# EAGLE design hackeeg-connector-8-vertical (EAGLE 9.5.2)
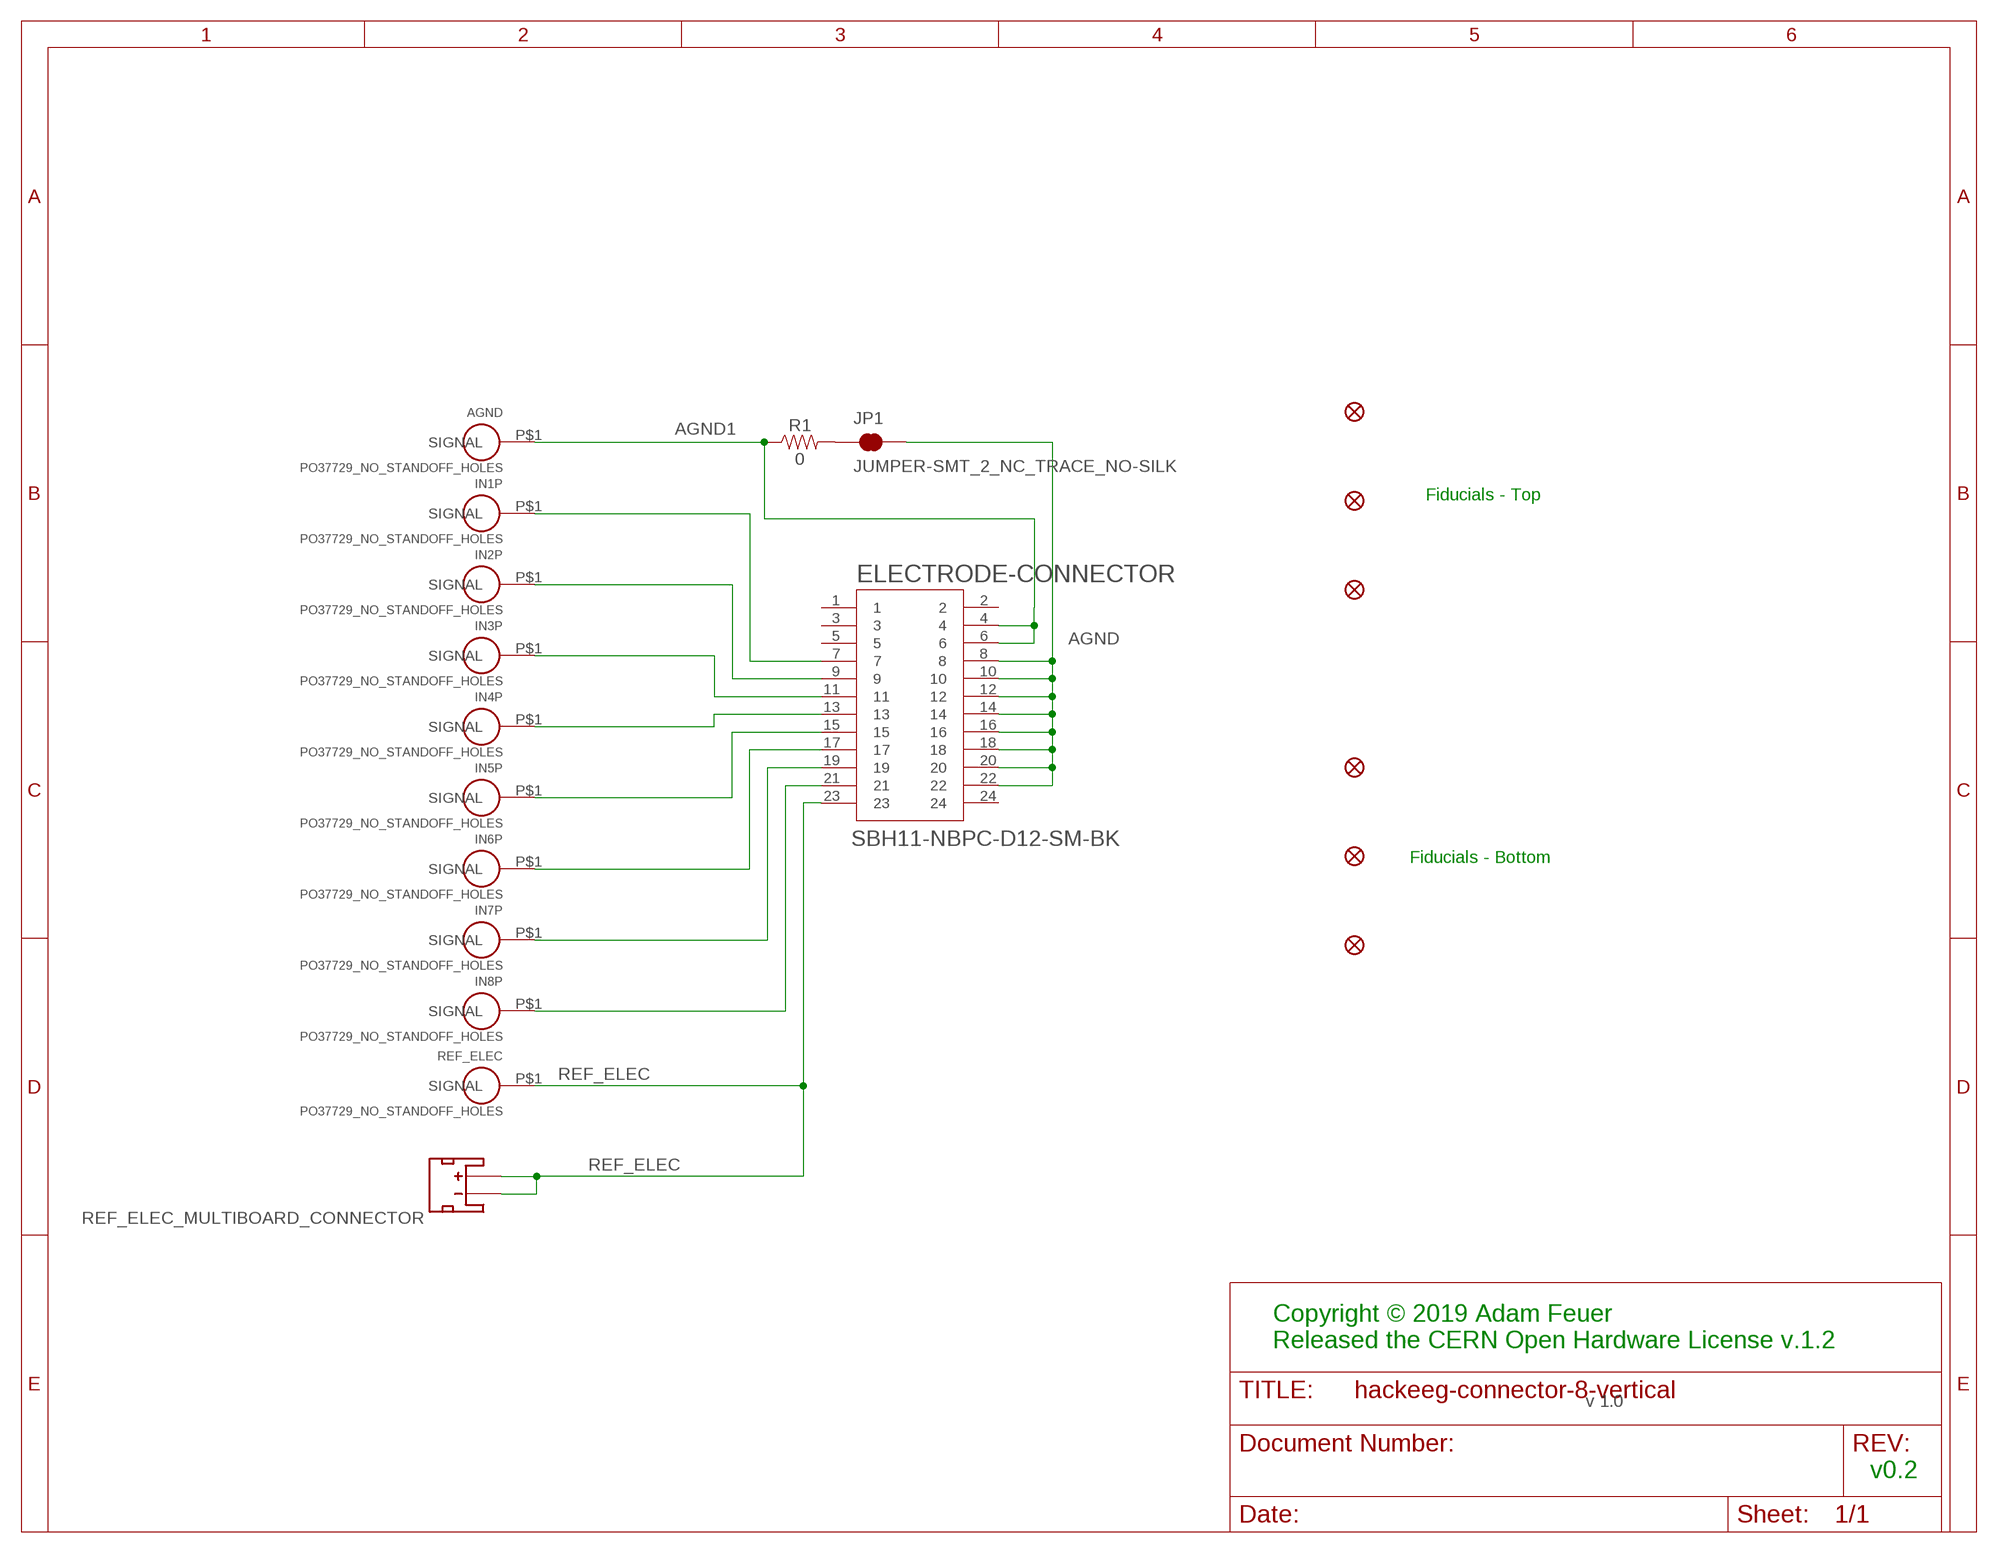
[diagram p0: schematic, sheet 1]

## Parts
AGND  PO37729_NO_STANDOFF_HOLES  [SIMPLE0]
ELECTRODE-CONNECTOR  SBH11-NBPC-D12-SM-BK  [SULLINS_SBH11-NBPC-D12-SM-BK]
FD1  FIDUCIAL1X2  [FIDUCIAL-1X2]
FD2  FIDUCIAL1X2  [FIDUCIAL-1X2]
FD3  FIDUCIAL1X2  [FIDUCIAL-1X2]
FD4  FIDUCIAL1X2  [FIDUCIAL-1X2]
FD5  FIDUCIAL1X2  [FIDUCIAL-1X2]
FD6  FIDUCIAL1X2  [FIDUCIAL-1X2]
IN1P  PO37729_NO_STANDOFF_HOLES  [SIMPLE0]
IN2P  PO37729_NO_STANDOFF_HOLES  [SIMPLE0]
IN3P  PO37729_NO_STANDOFF_HOLES  [SIMPLE0]
IN4P  PO37729_NO_STANDOFF_HOLES  [SIMPLE0]
IN5P  PO37729_NO_STANDOFF_HOLES  [SIMPLE0]
IN6P  PO37729_NO_STANDOFF_HOLES  [SIMPLE0]
IN7P  PO37729_NO_STANDOFF_HOLES  [SIMPLE0]
IN8P  PO37729_NO_STANDOFF_HOLES  [SIMPLE0]
JP1  JUMPER-SMT_2_NC_TRACE_NO-SILK  [SMT-JUMPER_2_NC_TRACE_NO-SILK]
R1  0  0OHM-0603-1/10W-5%  [0603]
REF_ELEC  PO37729_NO_STANDOFF_HOLES  [SIMPLE0]
REF_ELEC_MULTIBOARD_CONNECTOR  JST_2MM_MALE  [JST-2-SMD]

## Nets
AGND: ELECTRODE-CONNECTOR.8 ELECTRODE-CONNECTOR.10 ELECTRODE-CONNECTOR.12 ELECTRODE-CONNECTOR.14 ELECTRODE-CONNECTOR.16 ELECTRODE-CONNECTOR.18 ELECTRODE-CONNECTOR.20 ELECTRODE-CONNECTOR.22 JP1.2
AGND1: AGND.P$1(SIGNAL) ELECTRODE-CONNECTOR.4 ELECTRODE-CONNECTOR.6 R1.1
N$2: ELECTRODE-CONNECTOR.7 IN1P.P$1(SIGNAL)
N$3: ELECTRODE-CONNECTOR.9 IN2P.P$1(SIGNAL)
N$4: ELECTRODE-CONNECTOR.11 IN3P.P$1(SIGNAL)
N$5: ELECTRODE-CONNECTOR.13 IN4P.P$1(SIGNAL)
N$6: ELECTRODE-CONNECTOR.15 IN5P.P$1(SIGNAL)
N$7: ELECTRODE-CONNECTOR.17 IN6P.P$1(SIGNAL)
N$8: ELECTRODE-CONNECTOR.19 IN7P.P$1(SIGNAL)
N$9: ELECTRODE-CONNECTOR.21 IN8P.P$1(SIGNAL)
N$17: JP1.1 R1.2
REF_ELEC: ELECTRODE-CONNECTOR.23 REF_ELEC.P$1(SIGNAL) REF_ELEC_MULTIBOARD_CONNECTOR.1(-) REF_ELEC_MULTIBOARD_CONNECTOR.2(+)
Unconnected: ELECTRODE-CONNECTOR.1 ELECTRODE-CONNECTOR.2 ELECTRODE-CONNECTOR.3 ELECTRODE-CONNECTOR.5 ELECTRODE-CONNECTOR.24 REF_ELEC_MULTIBOARD_CONNECTOR.NC1(PAD1) REF_ELEC_MULTIBOARD_CONNECTOR.NC2(PAD2)

## Notes on the sheet
- Fiducials - Top
- Fiducials - Bottom
- Copyright © 2019 Adam Feuer
  Released the CERN Open Hardware License v.1.2
- v 1.0
- v0.2

## Library data of the parts
AGND IN1P IN2P IN3P IN4P IN5P IN6P IN7P IN8P REF_ELEC = hackeeg-connectors:PO37729: PO37729 – vertical electrode connector DIN 42-802
ELECTRODE-CONNECTOR = SBH11-NBPC-D12-SM-BK:SBH11-NBPC-D12-SM-BK: Conn Headr 2.54mm 24pos Gold Smd; AVAILABILITY: Warning; DESCRIPTION: Conn Headr 2.54mm 24pos Gold Smd; MF: Sullins Connector; MP: SBH11-NBPC-D12-SM-BK; PACKAGE: None; PRICE: 1.05 USD
FD1-FD6 = SparkFun-Aesthetics:FIDUCIAL: Fiducial Alignment Points Point-of-reference for pick-and-place machines and other optical instruments.
JP1 = SparkFun-Jumpers:JUMPER-SMT_2_NC_TRACE: Normally closed trace jumper This jumper has a trace between two pads so it's normally closed (NC). Use a razor knife to open the connection. For best results follow the IPC guidelines for cutting traces: Cutout at least 0.063 mm (0.005 in). Remove all loose material to clean up the cut area. Seal the cut with an approved epoxy. Reapply solder to reclose the connection.
R1 = SparkFun-Resistors:0OHM: 0Ω resistor A resistor is a passive two-terminal electrical component that implements electrical resistance as a circuit element. Resistors act to reduce current flow, and, at the same time, act to lower voltage levels within circuits. - Wikipedia; PROD_ID: RES-08609
REF_ELEC_MULTIBOARD_CONNECTOR = SparkFun-Connectors:JST_2MM_MALE: JST 2MM MALE RA CONNECTOR Two pin, compact surface mount connector. Commonly used as a battery input connection point. We really like the solid locking feeling and high current rating on these small connectors. We use these all the time as battery connectors. Mates to single-cell LiPo batteries. Here is the connector we sell at SparkFun: JST Right Angle Connector - White <https://www.sparkfun.com/products/8612> (PRT-08612) Datasheet <http://www.sparkfun.com/datasheets/Prototyping/Connectors/JST-Horizontal.pdf> It was used on these SparkFun products: SparkFun MOSFET Power Controller <https://www.sparkfun.com/products/11214> (PRT-11214) SparkFun Battery Babysitter - LiPo Battery Manager <https://www.sparkfun.com/products/13777> (PRT-13777) And many, many others that required a lipo battery connection.; PROD_ID: CONN-11443; SF_ID: PRT-08612

## Board
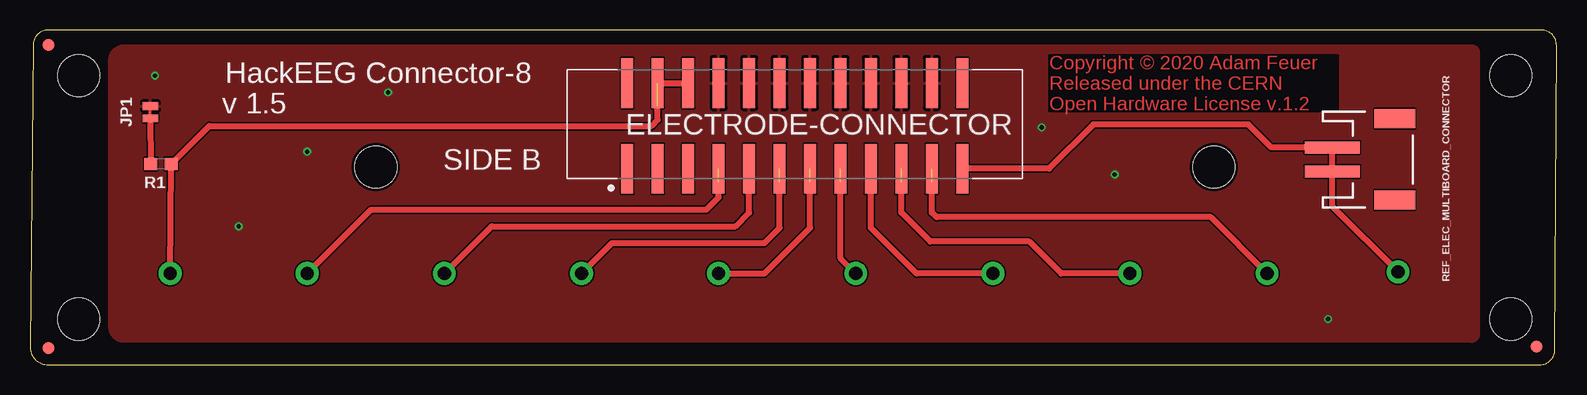
[diagram p1: board, top side]
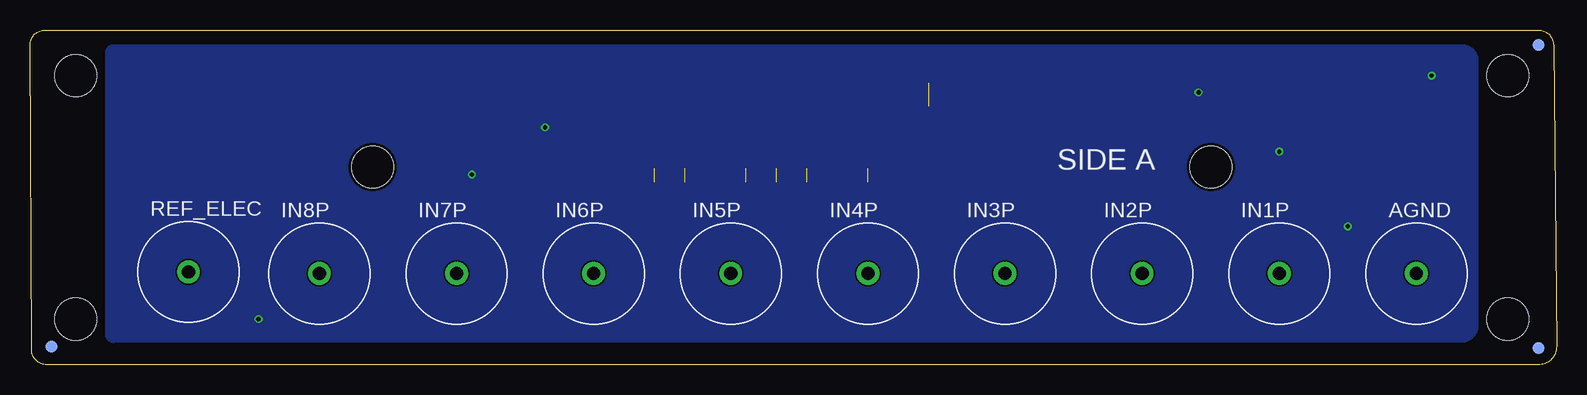
[diagram p2: board, bottom side, seen from below]

Size 127.25 x 27.94 mm. Coordinates in mm from the lower left corner, seen from the top.
Outline: 1.52,0 125.85,0 arc90 127.12,1.26 127.25,26.67 arc90 125.98,27.94 1.52,27.94 arc90 0.25,26.67 0,1.52 arc90 1.52,0
Copper layers (1*16): Top 0.035mm / dielectric 1.5mm / Bottom 0.035mm
Design rules "MF_Standard_2_Layer": minimum track width 5mil, minimum drill 12mil, track to track 5mil, track to pad 5mil, pad to pad 5mil, via to via 5mil, smd to smd 0mil, copper to edge 10mil, drill to drill 10mil, minimum pad ring 6mil, minimum via ring 6mil, stop-mask expansion 2mil, vias tented up to drill 25mil, thermal gap 10mil
Holes 3.5 mm at 4.06,24.13 4.06,3.81 123.44,3.81 123.44,24.13 28.83,16.51 98.68,16.51

### Footprints (pad centres in the part's own frame; a part is rotated, then mirrored left to right if it is on the bottom)
SIMPLE0 = drill 1.1 pad 1.9: P$1 0,0
SULLINS_SBH11-NBPC-D12-SM-BK = smd 1 x 4.15: 1 -13.97,-3.575; 2 -13.97,3.575; 3 -11.43,-3.575; 4 -11.43,3.575; 5 -8.89,-3.575; 6 -8.89,3.575; 7 -6.35,-3.575; 8 -6.35,3.575; 9 -3.81,-3.575; 10 -3.81,3.575; 11 -1.27,-3.575; 12 -1.27,3.575; 13 1.27,-3.575; 14 1.27,3.575; 15 3.81,-3.575; 16 3.81,3.575; 17 6.35,-3.575; 18 6.35,3.575; 19 8.89,-3.575; 20 8.89,3.575; 21 11.43,-3.575; 22 11.43,3.575; 23 13.97,-3.575; 24 13.97,3.575
FIDUCIAL-1X2 = smd 1 x 1: 1 0,0
SMT-JUMPER_2_NC_TRACE_NO-SILK = smd 0.635 x 1.27: 1 -0.508,0; 2 0.508,0
0603 = smd 1.1 x 1: 1 -0.85,0; 2 0.85,0
JST-2-SMD = smd 1 x 4.6: 1 -1,-3.7; 2 1,-3.7 | smd 1.6 x 3.4: NC1 -3.4,1.5; NC2 3.4,1.5

### Placement (x,y rotation side)
AGND  11.68,7.62 0 bottom
ELECTRODE-CONNECTOR  63.75,19.94 0 top
FD1  1.52,1.4 0 top
FD2  1.52,26.67 0 top
FD3  125.6,1.52 0 top
FD4  125.48,1.52 0 bottom
FD5  1.52,26.67 0 bottom
FD6  1.52,1.4 0 bottom
IN1P  23.11,7.62 0 bottom
IN2P  34.54,7.62 0 bottom
IN3P  45.97,7.62 0 bottom
IN4P  57.4,7.62 0 bottom
IN5P  68.83,7.62 0 bottom
IN6P  80.26,7.62 0 bottom
IN7P  91.69,7.62 0 bottom
IN8P  103.12,7.62 0 bottom
JP1  10.03,21.08 90 top
R1  10.92,16.76 180 top
REF_ELEC  114.05,7.75 0 bottom
REF_ELEC_MULTIBOARD_CONNECTOR  112.27,17.14 270 top

### Tracks (layer width: path | path; a pad name or v marks a point on that pad's centre or on a via)
AGND  (via drill 0.35)
  other vias: 23.11,17.78 10.41,24.13 17.4,11.56 84.33,19.81 90.42,15.88 108.2,3.81 29.85,22.73
  pour Top: 6.6,3.17 6.6,25.4 arc-90 7.87,26.67 120.14,26.67 arc-90 120.78,26.04 120.78,2.54 arc-90 120.14,1.91 7.87,1.91 arc-90
  pour Bottom: 6.6,25.4 6.6,3.3 arc90 8,1.91 120.27,1.91 arc90 120.9,2.54 120.9,26.04 arc90 120.27,26.67 7.87,26.67 arc90
AGND1  (1 unrouted)
  Top 0.508: AGND.P$1 R1.1 14.95,19.94 51.82,19.94 52.32,20.45 52.32,21.59 | ELECTRODE-CONNECTOR.4 ELECTRODE-CONNECTOR.6
N$2  (1 unrouted)
  Top 0.508: IN1P.P$1 28.45,12.95 56.39,12.95 57.4,13.97 57.4,15.24
N$3
  Top 0.508: IN2P.P$1 38.48,11.56 58.8,11.56 59.94,12.7 ELECTRODE-CONNECTOR.9
N$4  (1 unrouted)
  Top 0.508: IN3P.P$1 48.51,10.16 61.21,10.16 62.48,11.43 62.48,15.24
N$5  (1 unrouted)
  Top 0.508: IN4P.P$1 61.21,7.62 65.02,11.43 65.02,15.24
N$6  (1 unrouted)
  Top 0.508: IN5P.P$1 67.56,8.89 67.56,15.24
N$7
  Top 0.508: IN6P.P$1 73.91,7.62 70.1,11.43 ELECTRODE-CONNECTOR.17
N$8  (1 unrouted)
  Top 0.508: IN7P.P$1 85.98,7.62 83.31,10.29 75.06,10.29 72.64,12.7 72.64,15.24
N$9  (1 unrouted)
  Top 0.508: IN8P.P$1 98.43,12.32 75.57,12.32 75.18,12.7 75.18,15.24
N$17
  Top 0.508: JP1.1 R1.2
REF_ELEC
  Top 0.508: REF_ELEC.P$1 108.57,13.23 REF_ELEC_MULTIBOARD_CONNECTOR.2 REF_ELEC_MULTIBOARD_CONNECTOR.1 103.49,18.14 101.58,20.05 88.63,20.05 84.94,16.36 ELECTRODE-CONNECTOR.23

### Text on the board
Top: Copyright © 2020 Adam Feuer / Released under the CERN / Open Hardware License v.1.2
tNames: HackEEG Connector-8 | v 1.5 | SIDE B
bNames: SIDE A